# Altium schematic sheet Smart Agriculture Schematic.SchDoc
size A4
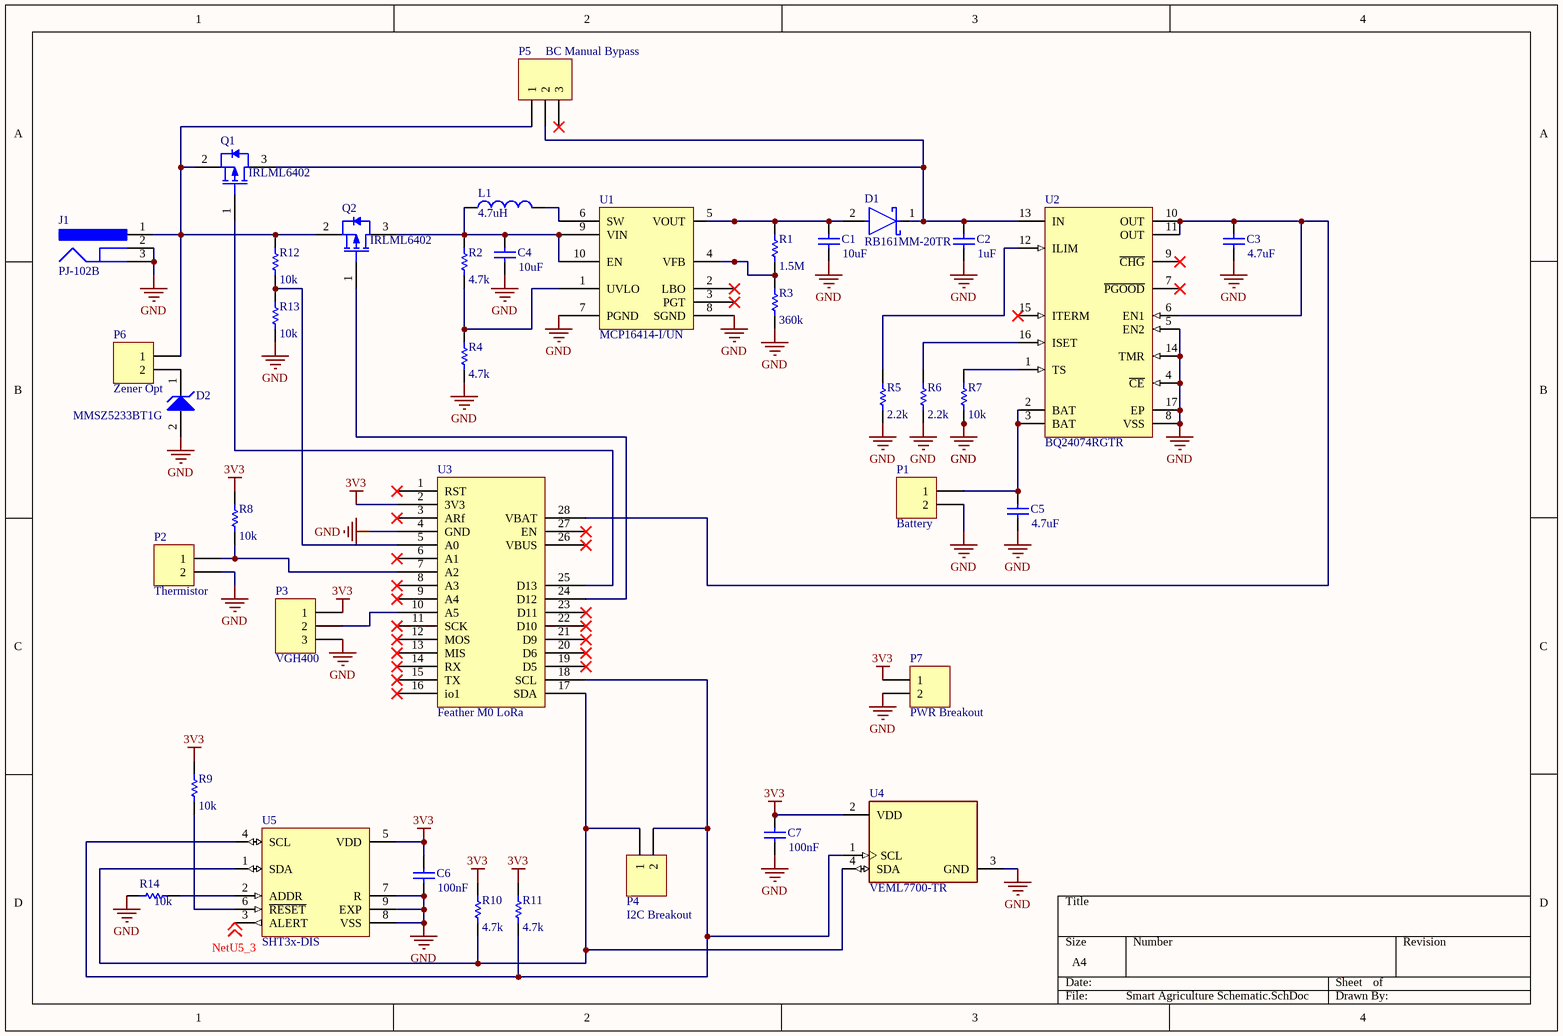
[diagram p0: Smart Agriculture Schematic.SchDoc]

## Parts
C1  value 10uF  [1608[0603]]
C2  value 1uF  [1608[0603]]
C3  value 4.7uF  [1608[0603]]
C4  value 10uF  [1608[0603]]
C5  value 4.7uF  [1608[0603]]
C6  value 100nF  [1608[0603]]
C7  value 100nF  [1608[0603]]
D1  RB161MM-20TR  [FP-PMDU-MFG]
D2  MMSZ5233BT1G  [ONSC-SOD-123-2-425-04_V]
J1  PJ-102B  [CUI-PJ-102B_V]
L1  value 4.7uH  [1812]
P1  Battery  [HDR1X2]
P2  Thermistor  [HDR1X2]
P3  VGH400  [HDR1X3]
P4  I2C Breakout  [HDR1X2]
P5  BC Manual Bypass  [HDR1X3]
P6  Zener Opt  [HDR1X2]
P7  PWR Breakout  [HDR1X2]
Q1  IRLML6402  [INTR-SOT-23-3_V]
Q2  IRLML6402  [INTR-SOT-23-3_V]
R1  value 1.5M  [1608[0603]]
R2  value 4.7k  [1608[0603]]
R3  value 360k  [1608[0603]]
R4  value 4.7k  [1608[0603]]
R5  value 2.2k  [1608[0603]]
R6  value 2.2k  [1608[0603]]
R7  value 10k  [1608[0603]]
R8  value 10k  [1608[0603]]
R9  value 10k  [1608[0603]]
R10  value 4.7k  [1608[0603]]
R11  value 4.7k  [1608[0603]]
R12  value 10k  [1608[0603]]  (hidden comment: Res1)
R13  value 10k  [1608[0603]]  (hidden comment: Res1)
R14  value 10k  [1608[0603]]
U1  MCP16414-I/UN  [MSOP10_UN_MCH]
U2  BQ24074RGTR  [RGT0016C_V]
U3  Feather M0 LoRa  [FeatherM0LoRa]
U4  VEML7700-TR  [FP-6_550-5300_02-4-MFG]
U5  SHT3x-DIS  [SHT3x]

## Nets
3V3: C6.2 C7.2 P3.1 P7.1 R8.2 R9.2 R10.2 R11.2 U3.2(3V3) U4.2(VDD) U5.5(VDD)
GND: C1.1 C2.1 C3.1 C4.1 C5.1 C6.1 C7.1 D2.2(A) J1.2 J1.3 P1.2 P2.2 P3.3 P7.2 R3.1 R4.1 R5.1 R6.1 R7.1 R13.1 R14.1 U1.7(PGND) U1.8(SGND) U2.4(~{CE}) U2.5(EN2) U2.8(VSS) U2.14(TMR) U2.17(EP) U3.4(GND) U4.3(GND) U5.7(R) U5.8(VSS) U5.9(EXP)
NetU5_3: U5.3(ALERT) ; off-sheet NetU5_3
NetC1_2: C1.2 D1.2(A) R1.2 U1.5(VOUT)
NetC2_2: C2.2 D1.1(C) P5.2 Q1.3(DRAIN) U2.13(IN)
NetC3_2: C3.2 U2.6(EN1) U2.10(OUT) U2.11(OUT) U3.28(VBAT)
NetC4_2: C4.2 L1.1 Q2.3(DRAIN) R2.2 U1.9(VIN) U1.10(EN)
NetC5_2: C5.2 P1.1 U2.2(BAT) U2.3(BAT)
NetD2_1: D2.1(K) P6.2
NetJ1_1: J1.1 P5.1 P6.1 Q1.2(SOURCE) Q2.2(SOURCE) R12.2
NetL1_2: L1.2 U1.6(SW)
NetP2_1: P2.1 R8.1 U3.7(A2)
NetP3_2: P3.2 U3.10(A5)
NetP4_1: P4.1 R10.1 U3.17(SDA) U4.4(SDA) U5.1(SDA)
NetP4_2: P4.2 R11.1 U3.18(SCL) U4.1(SCL) U5.4(SCL)
NetQ1_1: Q1.1(GATE) U3.25(D13)
NetQ2_1: Q2.1(GATE) U3.24(D12)
NetR1_1: R1.1 R3.2 U1.4(VFB)
NetR2_1: R2.1 R4.2 U1.1(UVLO)
NetR5_2: R5.2 U2.12(ILIM)
NetR6_2: R6.2 U2.16(ISET)
NetR7_2: R7.2 U2.1(TS)
NetR9_1: R9.1 U5.6(~{RESET})
NetR12_1: R12.1 R13.2 U3.5(A0)
NetR14_2: R14.2 U5.2(ADDR)

Not connected (* = marked no-connect by the designer): P5 3*; U1 2(LBO)* 3(PGT)*; U2 7(~{PGOOD})* 9(~{CHG})* 15(ITERM)*; U3 1(RST)* 3(ARf)* 6(A1)* 8(A3)* 9(A4)* 11(SCK)* 12(MOS)* 13(MIS)* 14(RX)* 15(TX)* 16(io1)* 19(D5)* 20(D6)* 21(D9)* 22(D10)* 23(D11)* 26(VBUS)* 27(EN)*

## Library data of the parts
C1-C7 = Cap: Capacitor; Published: 8-Jun-2000; LatestRevisionDate: 17-Jul-2002; LatestRevisionNote: Re-released for DXP Platform.; PackageReference: RAD-0.3; Publisher: Altium Limited; PackageDescription: Radial Cap, Thru-Hole; 2 Leads; 0.3 in Pin Spacing
D1 = CMP-08971-000004-1: DIODE SCHOTTKY 25V 1A PMDU; Manufacturer: Rohm; Max Junction Temp: +125°C; Reverse Voltage: 20V; Max Surge Forward Current: 30A; Peak Reverse Current: 280uA; Height: 0.9mm; RoHS: TRUE; Octopart: https://octopart.com/rb161mm-20tr-rohm-50255147; Max Repetitive Reverse Voltage: 25V; Device Class L2: Diodes; Manufacturer Part Number: RB161MM-20TR; Category: Diode; Automotive: No; Device Class L1: Discrete Semiconductors; Device Class L3: Schottky Diodes; Package: PMDU; Lead Free: Yes; Mouser Description: RB161MM Series 25 V 1 A Surface Mount Schottky Barrier Diode - SOD-123FL; Digikey Description: DIODE SCHOTTKY 25V 1A PMDU; ComponentLink2Description: Datasheet; Temperature: to +125°C; Temperature Range High: +125°C; ComponentLink2URL: https://www.rohm.com/datasheet/RB161MM-20/rb161mm-20tr-e; Forward Current: 1A
D2 = CMP-1060-00590-1: Zener Voltage Regulator, 500 mW, 2-Pin SOD-123, Pb-Free, Tape and Reel; Manufacturer: On Semiconductor; VZ Typ (V): 6.0; P Max (W): 0.5; PackageReference: SOD-123-2-425-04; ComponentLink3URL: http://www.onsemi.com/pub_link/Collateral/425-04.PDF; DatasheetVersion: Rev. 12; PackageDescription: 2-Pin SOD, Body 1.6 x 2.69 mm; ComponentLink2URL: http://www.onsemi.com/pub_link/Collateral/MMSZ5221BT1-D.PDF; ComponentLink1URL: http://www.onsemi.com/; Mounting Technology: Surface Mount; PartNumber: MMSZ5233BT1G; ComponentLink3Description: Package Specification; ComponentLink2Description: Datasheet; ComponentLink1Description: Manufacturer URL; RoHS: Pb-Free; Packing: Tape and Reel; PackageVersion: Rev. G, 10/2009
J1 = CMP-2000-06900-1: Through Hole Right Angle DC Power Jack, 2.5 A, 2.5 mm Center Pin, 3 Position, -25 to 85 degC, RoHS, Bulk; Manufacturer: CUIInc.; Insulation Resistance: 100MOhms; Inside Contact Diameter: 2.5mm; Outside Contact Diameter: 6.5mm; Voltage Rating: 24V; Current Rating: 2.5A; Brand: CUI; Datasheet URL: http://www.cui.com/product/resource/pj-102b.pdf; Housing Material: PolybutyleneTerephthalate(PBT); Operating Temperature Range: -25Cto+85C; Package Reference: PJ-102B; Factory Pack Quantity: 280; RoHS: True; Contact Material: Copper; Datasheet Version: Rev. 1.03, 04/2016; Product: Jacks; Mounting Angle: Right; Mounting Style: ThroughHole; Flammability Rating: UL94V-0; Product Category: DCPowerConnectors; Contact Gender: Male; Termination Style: ThroughHole; Manufacturer URL: http://www.cui.com/; Mounting Technology: ThroughHole; Package Description: 3-Pin Through Hole Device, Body 14.4 x 9 mm, Height 11 mm; Contact Plating: Nickel; Packaging: Bulk; Connector Type: DCPowerJack
L1 = Inductor: Code_IEC: 1005; Published: 8-Jun-2000; LatestRevisionDate: 29-May-2009; LatestRevisionNote: IPC-7351 Footprint Added.; PackageReference: 0402-A; Publisher: Altium Limited; PackageDescription: Chip Inductor; Code_JEITA: 0402
P1 P2 P4 P6 P7 = Header 2: Header, 2-Pin; LatestRevisionDate: 17-Jul-2002; LatestRevisionNote: Re-released for DXP Platform.; Publisher: Altium Limited
P3 P5 = Header 3: Header, 3-Pin; LatestRevisionDate: 17-Jul-2002; LatestRevisionNote: Re-released for DXP Platform.; Publisher: Altium Limited
Q1 Q2 = CMP-2000-04987-1: HEXFET(R) Power P-Channel MOSFET, -20 V, -3.7 A, -55 to 150 degC, 3-Pin SOT-23, RoHS, Tape and Reel; Manufacturer: International Rectifier; Drain-to-Source Voltage [Vdss]: 20V; Rated Power Dissipation: 1.3W; Qg Gate Charge: 8nC; Drain-Source On Resistance-Max: 0.065O; Channel Type: P-Channel; Package Reference: SOT-23-3; Manufacturer URL: http://internationalrectifier.com/; Datasheet URL: http://datasheet.octopart.com/IRLML6402TRPBF-International-Rectifier-datasheet-93882.pdf; Datasheet Version: Feb-05; Package Description: 3-Pin Small Outline Transistor, Body 2.92 x 1.3 mm, Pitch 0.95 mm
R1-R14 = Res1: Resistor; Published: 8-Jun-2000; LatestRevisionDate: 17-Jul-2002; LatestRevisionNote: Re-released for DXP Platform.; PackageReference: AXIAL-0.3; Publisher: Altium Limited; PackageDescription: Axial Device, Thru-Hole; 2 Leads; 0.3 in Pin Spacing
U1 = Component_1
U2 = CMP-0321-00220-2: USB-Friendly Li-Ion Battery Charger and Power-Path Management IC, 10.5 V OVP, 4.3 V, -40 to 85 degC, 16-pin QFN (RGT), Green (RoHS & no Sb/Br); Manufacturer: Texas Instruments; NiCd: N; Vin(Min)(V): 4.3; SubFamily: Battery Charge Management; PartNumber: BQ24074RGTR; NiMH: N; ComponentLink1Description: Datasheet; ComponentLink1URL: http://www.ti.com/general/docs/lit/getliterature.tsp?genericPartNumber=BQ24074&fileType=pdf; PackageDescription: 16-Pin Plastic Quad Flat No-Lead, 3 x 3 mm Body, 0.5 mm Pitch, 1.7 x 1.7 mm Exposed Pad; Eco-Plan: Green (RoHS & no Sb/Br); PackageVersion: revH, Oct-2011; Li-Polymer: N; Li-Ion: N; Lead Acid: N; Over Voltage Protection: N; PackageReference: RGT0016C; DatasheetVersion: SLUS810G; Code_JEDEC: MO-220; Mounting Technology: Surface Mount
U4 = CMP-02530-000005-1: SENSOR OPT 545NM AMBIENT 4SMD; Manufacturer: Vishay; Sensor Output: I2C; Max Supply Voltage: 3.6V; Operating Supply Current: 2-45uA; Min Supply Voltage: 2.5V; Max Junction Temp: +100°C; Height: 3.15mm; Category: IC; Automotive: No; Ambient Temperature Range Low: -25°C; Octopart: https://octopart.com/veml7700-tr-vishay-70519713; Ambient Temperature Range High: +85°C; Lead Free: Yes; Manufacturer Part Number: VEML7700-TR; Device Class L3: unset; Temperature Range High: +100°C; ComponentLink2URL: http://www.vishay.com/docs/84286/veml7700.pdf; Package: 6.550-5300.02-4; Digikey Description: SENSOR OPT 545NM AMBIENT 4SMD; Device Class L2: Optical Sensors; RoHS: TRUE; Temperature: to +100°C; ComponentLink2Description: Datasheet; Device Class L1: Sensors